# EAGLE schematic Aquarium_Nano (EAGLE 6.5.0)
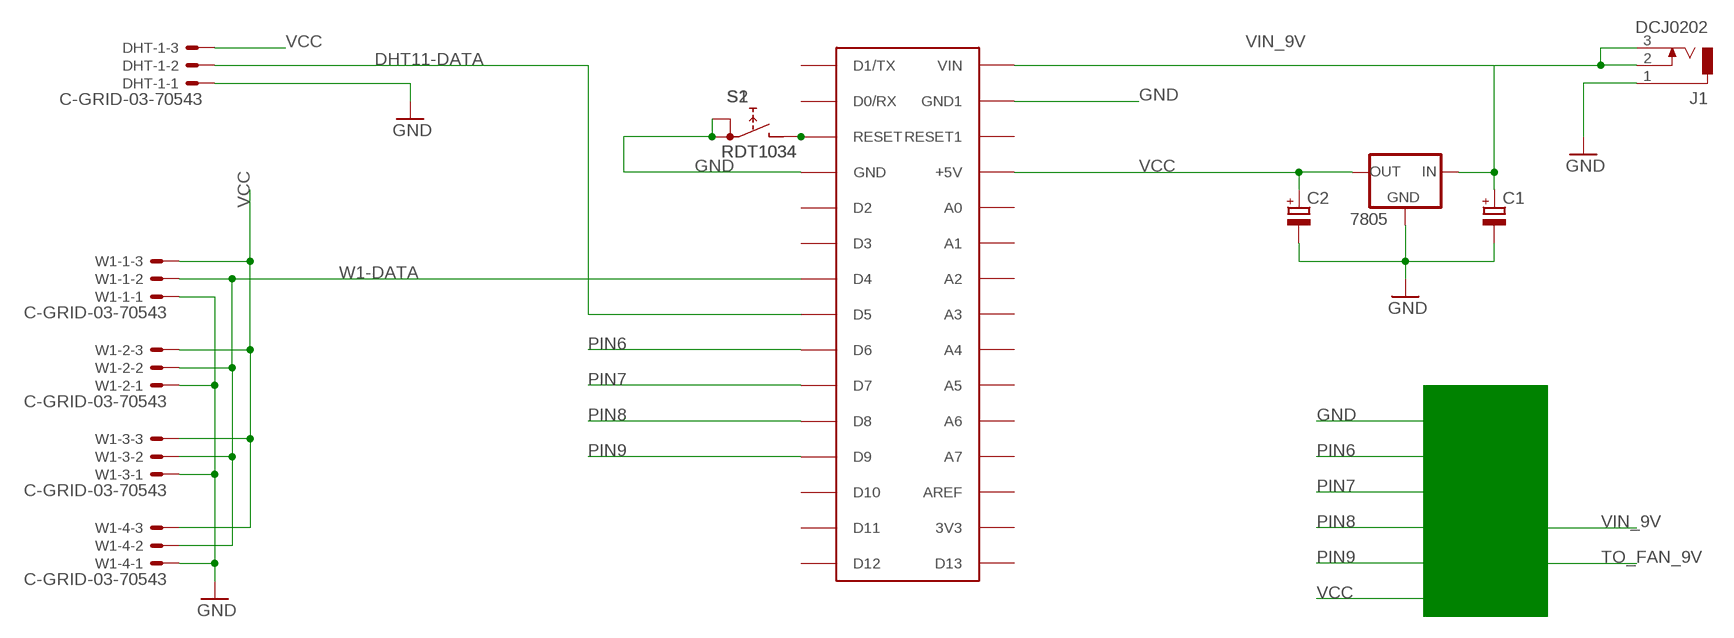
[diagram p0: schematic, sheet 1]

## Parts
7805  V_REG_78XX-TO-220  [TO-220-ALT]
C1  CPOL-EUE2.5-6  [E2,5-6]
C2  CPOL-EUE2.5-6  [E2,5-6]
DHT-1  C-GRID-03-70543  [70543-03]
J1  DCJ0202  [DCJ0202]
S1  RDT1034  [RDT1034]
S2  RDT1034  [RDT1034]
U$2  ARDUINONANO  [PDIP-32]
W1-1  C-GRID-03-70543  [70543-03]
W1-2  C-GRID-03-70543  [70543-03]
W1-3  C-GRID-03-70543  [70543-03]
W1-4  C-GRID-03-70543  [70543-03]

## Nets
DHT11-DATA: DHT-1.2 U$2.D5
GND: 7805.GND C1.- C2.- DHT-1.1 J1.1 S1.A S1.A1 S2.A S2.A1 U$2.GND U$2.GND1 W1-1.1 W1-2.1 W1-3.1 W1-4.1
N$1: S1.B S2.B U$2.RESET
PIN6: U$2.D6
PIN7: U$2.D7
PIN8: U$2.D8
PIN9: U$2.D9
VCC: 7805.OUT C2.+ DHT-1.3 U$2.+5V W1-1.3 W1-2.3 W1-3.3 W1-4.3
VIN_9V: 7805.IN C1.+ J1.2 J1.3 U$2.VIN
W1-DATA: U$2.D4 W1-1.2 W1-2.2 W1-3.2 W1-4.2
Unconnected: U$2.3V3 U$2.A0 U$2.A1 U$2.A2 U$2.A3 U$2.A4 U$2.A5 U$2.A6 U$2.A7 U$2.AREF U$2.D0/RX U$2.D1/TX U$2.D2 U$2.D3 U$2.D10 U$2.D11 U$2.D12 U$2.D13 U$2.RESET1

## Library data of the parts
7805 = SparkFun-PowerIC:V_REG_78XX: Voltage Regulator Standard 7805 5V regulator. IGO (Input Ground Output). Spark Fun Electronics SKU : COM-00107
C1 C2 = rcl:CPOL-EU: POLARIZED CAPACITOR, European symbol
DHT-1 W1-1-W1-4 = con-molex:C-GRID-03: CONNECTOR wire to board 2.54 mm (0.100") pitch header; OC_FARNELL: unknown; OC_NEWARK: unknown
J1 = con-jack:DCJ0202: DC POWER JACK Source: DCJ0202.pdf; OC_FARNELL: unknown; OC_NEWARK: unknown
S1 S2 = switch:RDT1034: PUSH SWITCH www.radiohm.com
U$2 = jet-lib:ARDUINONANO